# EAGLE design AirSensor (EAGLE 9.6.2)
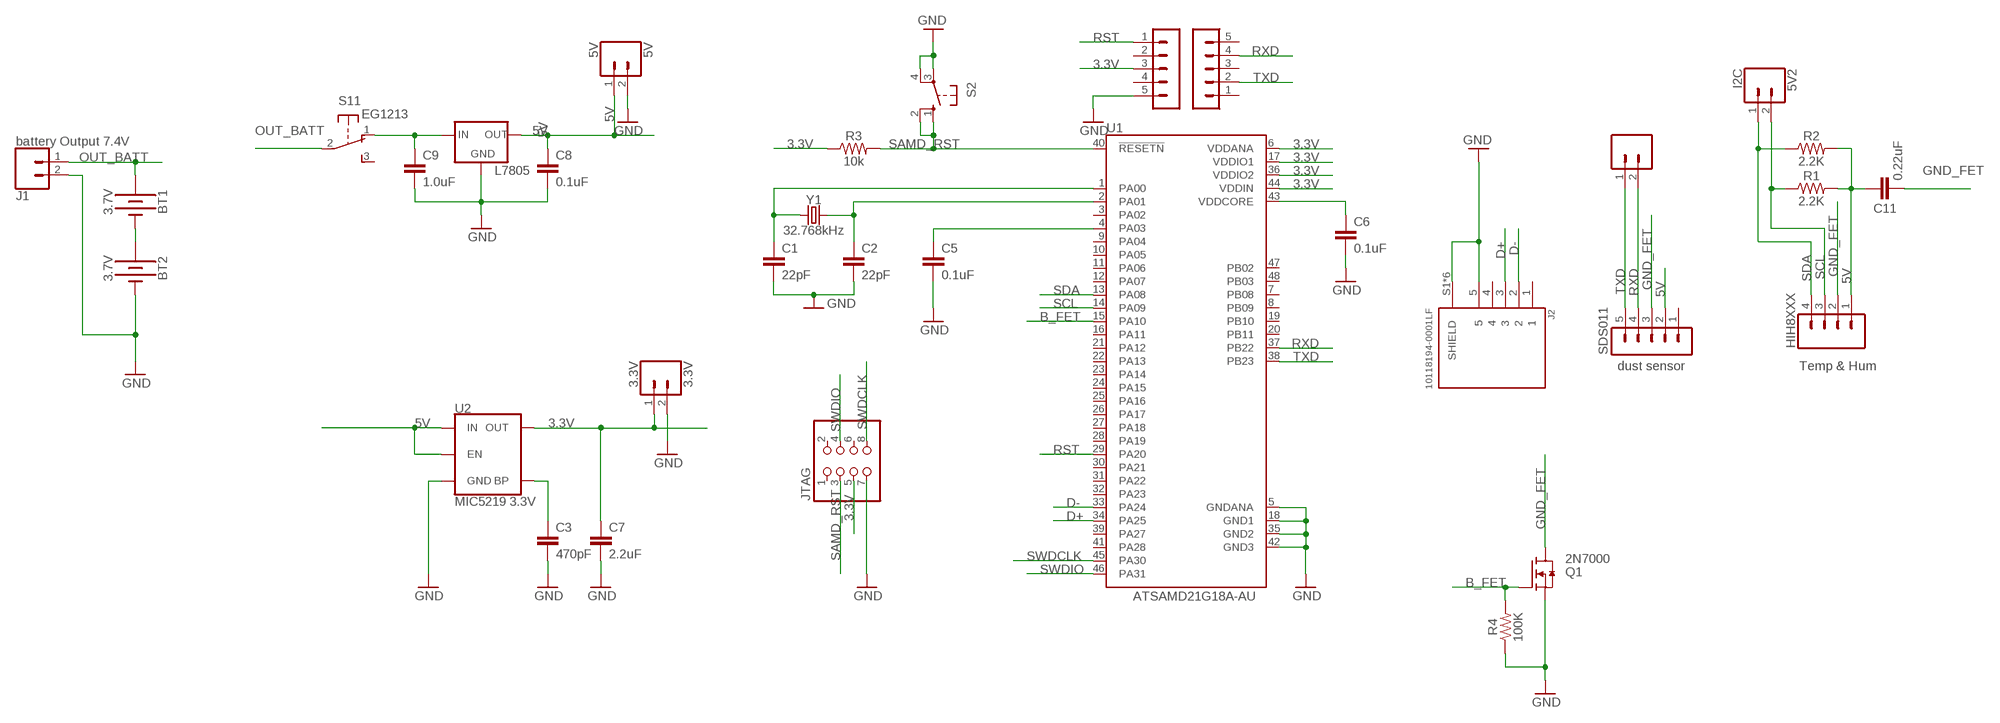
[diagram p0: schematic, sheet 1]

## Parts
3.3V  3.3V  CONN_02  [1X02]
5V  5V  CONN_02  [1X02]
5V1  UART  CONN_02  [1X02]
5V2  I2C  CONN_02  [1X02]
BT1  3.7V  BATTERY-18650  [BATTERY_18650-HOLDER]
BT2  3.7V  BATTERY-18650  [BATTERY_18650-HOLDER]
C1  22pF  1.0UF-0805-25V-10%  [0805]
C2  22pF  1.0UF-0805-25V-10%  [0805]
C3  470pF  1.0UF-0805-25V-10%  [0805]
C5  0.1uF  1.0UF-0805-25V-10%  [0805]
C6  0.1uF  1.0UF-0805-25V-10%  [0805]
C7  2.2uF  1.0UF-0805-25V-10%  [0805]
C8  0.1uF  1.0UF-0805-25V-10%  [0805]
C9  1.0uF  1.0UF-0805-25V-(+80/-20%)  [0805]
C11  0.22uF  1.0UF-0805-25V-10%  [0805]
HIH8XXX  Temp & Hum  CONN_04  [1X04]
J1  battery Output 7.4V  CONN_02  [1X02]
J2  10118194-0001LF  [AMPHENOL_10118194-0001LF]
JTAG  PINHD-2X4  [2X04]
L7805  V_REG_78XXSINK  [TO220-IGO]
Q1  2N7000  [TO92]
R1  2.2K  0.3OHM-0805-1/8W-1%  [0805]
R2  2.2K  0.3OHM-0805-1/8W-1%  [0805]
R3  10k  0.3OHM-0805-1/8W-1%  [0805]
R4  100K  0.3OHM-0805-1/8W-1%  [0805]
RN2483  LoRa1  MA05-1  [MA05-1]
RN2483_2  LoRa_2  MA05-1  [MA05-1]
S1  EG1213  [EG1213]
S2  10-XX  [B3F-10XX]
SDS011  dust sensor  MA05-1  [MA05-1]
U1  ATSAMD21G18A-AU  [QFP50P900X900X120-48N]
U2  MIC5219 3.3V  V_REG_MIC52193.3V  [SOT23-5]
Y1  32.768kHz  CRYSTAL-32.768KHZSMD-3.2X1.5  [CRYSTAL-SMD-3.2X1.5MM]

## Nets
3.3V: 3.3V.1 C7.1 JTAG.5 R3.1 RN2483.3 U1.6(VDDANA) U1.17(VDDIO1) U1.36(VDDIO2) U1.44(VDDIN) U2.5(OUT)
5V: 5V.1 C8.1 C11.1 HIH8XXX.1 L7805.OUT R1.2 R2.2 SDS011.2 U2.1(IN) U2.3(EN)
B_FET: Q1.2(G) R4.2 U1.15(PA10)
D+: J2.3 U1.34(PA25)
D-: J2.2 U1.33(PA24)
GND: 3.3V.2 5V.2 BT2.GND@1(-) C1.2 C2.2 C3.2 C5.2 C6.2 C7.2 C8.2 C9.2 J1.2 J2.5 J2.S1(SHIELD) J2.S2(SHIELD) J2.S3(SHIELD) J2.S4(SHIELD) J2.S5(SHIELD) J2.S6(SHIELD) JTAG.7 L7805.GND Q1.1(S) R4.1 RN2483.5 S2.3(P) S2.4(P1) U1.5(GNDANA) U1.18(GND1) U1.35(GND2) U1.42(GND3) U2.2(GND)
GND_FET: C11.2 HIH8XXX.2 Q1.3(D) SDS011.3
N$4: C5.1 U1.4(PA03)
N$5: C6.1 U1.43(VDDCORE)
N$6: C1.1 U1.1(PA00) Y1.P$1
N$7: C3.1 U2.4(BP)
N$8: BT1.GND@1(-) BT2.PWR@1(+)
N$9: C2.1 U1.2(PA01) Y1.P$2
OUT_BATT: BT1.PWR@1(+) C9.1 J1.1 L7805.IN S1.1(1:O) S1.2(1:P)
RST: RN2483.1 U1.29(PA20)
RXD: 5V1.2 RN2483_2.4 SDS011.4 U1.37(PB22)
SAMD_RST: JTAG.3 R3.2 S2.1(S) S2.2(S1) U1.40(!RESETN)
SCL: 5V2.2 HIH8XXX.3 R1.1 U1.14(PA09)
SDA: 5V2.1 HIH8XXX.4 R2.1 U1.13(PA08)
SWDCLK: JTAG.8 U1.45(PA30)
SWDIO: JTAG.4 U1.46(PA31)
TXD: 5V1.1 RN2483_2.2 SDS011.5 U1.38(PB23)
Unconnected: J2.1 J2.4 JTAG.1 JTAG.2 JTAG.6 RN2483.2 RN2483.4 RN2483_2.1 RN2483_2.3 RN2483_2.5 S1.3(1:S) S1.MT1(MT) S1.MT2(MT) SDS011.1 U1.3(PA02) U1.7(PB08) U1.8(PB09) U1.9(PA04) U1.10(PA05) U1.11(PA06) U1.12(PA07) U1.16(PA11) U1.19(PB10) U1.20(PB11) U1.21(PA12) U1.22(PA13) U1.23(PA14) U1.24(PA15) U1.25(PA16) U1.26(PA17) U1.27(PA18) U1.28(PA19) U1.30(PA21) U1.31(PA22) U1.32(PA23) U1.39(PA27) U1.41(PA28) U1.47(PB02) U1.48(PB03)

## Library data of the parts
3.3V 5V 5V1 5V2 J1 = SparkFun-Connectors:CONN_02: Multi connection point. Often used as Generic Header-pin footprint for 0.1 inch spaced/style header connections On any of the 0.1 inch spaced packages, you can populate with these: Break Away Headers - Straight <https://www.sparkfun.com/products/116> (PRT-00116) Break Away Male Headers - Right Angle <https://www.sparkfun.com/products/553> (PRT-00553) Female Headers <https://www.sparkfun.com/products/115> (PRT-00115) Break Away Headers - Machine Pin <https://www.sparkfun.com/products/117> (PRT-00117) Break Away Female Headers - Swiss Machine Pin <https://www.sparkfun.com/products/743> (PRT-00743) For SCREWTERMINALS and SPRING TERMINALS visit here: Screw Terimnals on SparkFun.com <https://www.sparkfun.com/search/results?term=Screw+Terminals> (5mm/3.5mm/2.54mm spacing) This device is also useful as a general connection point to wire up your design to another part of your project. Our various solder wires solder well into these plated through hole pads. Hook-Up Wire - Assortment (Stranded, 22 AWG) <https://www.sparkfun.com/products/11375> (PRT-11375) Hook-Up Wire - Assortment (Solid Core, 22 AWG) <https://www.sparkfun.com/products/11367> (PRT-11367) View the entire wire category on our website here <https://www.sparkfun.com/categories/141> Special notes: Molex polarized connector foot print use with: PRT-08233 with associated crimp pins and housings. 2.54_SCREWTERM for use with PRT-10571. 3.5mm Screw Terminal footprints for PRT-08084 5mm Screw Terminal footprints for use with PRT-08432
BT1 BT2 = SparkFun-Batteries:BATTERY: Battery - Single Cell A variety of battery chemistries, sizes, and footprints. Device List: 20MM_PTH - Coin Cell Battery Holder - 20mm (PTH) <https://www.sparkfun.com/products/783> 6.8MM_PTH - Coin Cell Battery Holder - 6.8MM(SMD) <https://www.digikey.com/product-detail/en/seiko-instruments/MS621FE-FL11E/728-1057-ND/1889208?WT.srch=1&gclid=CNOQ5a6LzdQCFZS2wAodXCkE0g> 12MM_SMD - Coin Cell Battery Holder - 12mm (SMD) <https://www.sparkfun.com/products/10592> 12MM_PTH - Coin Cell Battery Holder - 12mm (PTH) <https://www.sparkfun.com/products/7948> 20MM_SMD - 20mm Coin Cell Battery Holder (SMD) (2 legs) Used on the Big Time Watch Kit <https://www.sparkfun.com/products/11734> 20MM_SMD_4LEGS - Coin Cell Battery Holder - 20mm (SMD) <https://www.sparkfun.com/products/11892> 20MM_SMD_4LEGS_OVERPASTE - Coin Cell Battery Holder - 20mm (SMD) <https://www.sparkfun.com/products/11892> (Over-paste on the legs) 24.5MM_PTH - Coin Cell Battery Holder - 24.5mm (PTH) <https://www.sparkfun.com/products/8863> 9V - 9V Battery Holder - PC Mount Used on the SparkFun SparkPunk Sound Kit <https://www.sparkfun.com/products/11177> and SparkFun SparkPunk Sequencer Kit <https://www.sparkfun.com/products/12707> 18650 - Battery Holder - 18650 (PTH) <https://www.sparkfun.com/products/13113> AA - Battery Holder - 1xAA (PTH) <https://www.sparkfun.com/products/7949> AAA - Battery Holder - 1xAAA (PTH) <https://www.sparkfun.com/products/12718> AA_KIT - Battery Holder - 1xAA (PTH) <https://www.sparkfun.com/products/7949> Special kit package - pads only have exposed copper on one side of the board. AAA_KIT - Battery Holder - 1xAAA (PTH) <https://www.sparkfun.com/products/12718> Special kit package - pads only have exposed copper on one side of the board.; PROD_ID: BATT-12327; SF_SKU: PRT-13113
C1-C3 C5-C8 C11 = SparkFun-Capacitors:1.0UF: 1µF ceramic capacitors A capacitor is a passive two-terminal electrical component used to store electrical energy temporarily in an electric field.; PROD_ID: CAP-08064; VALUE: 1.0uF
C9 = SparkFun-Capacitors:1.0UF: 1µF ceramic capacitors A capacitor is a passive two-terminal electrical component used to store electrical energy temporarily in an electric field.; PROD_ID: CAP-11625
HIH8XXX = SparkFun-Connectors:CONN_04: Multi connection point. Often used as Generic Header-pin footprint for 0.1 inch spaced/style header connections On any of the 0.1 inch spaced packages, you can populate with these: Break Away Headers - Straight <https://www.sparkfun.com/products/116> (PRT-00116) Break Away Male Headers - Right Angle <https://www.sparkfun.com/products/553> (PRT-00553) Female Headers <https://www.sparkfun.com/products/115> (PRT-00115) Break Away Headers - Machine Pin <https://www.sparkfun.com/products/117> (PRT-00117) Break Away Female Headers - Swiss Machine Pin <https://www.sparkfun.com/products/743> (PRT-00743) For SCREWTERMINALS and SPRING TERMINALS visit here: Screw Terimnals on SparkFun.com <https://www.sparkfun.com/search/results?term=Screw+Terminals> (5mm/3.5mm/2.54mm spacing) This device is also useful as a general connection point to wire up your design to another part of your project. Our various solder wires solder well into these plated through hole pads. Hook-Up Wire - Assortment (Stranded, 22 AWG) <https://www.sparkfun.com/products/11375> (PRT-11375) Hook-Up Wire - Assortment (Solid Core, 22 AWG) <https://www.sparkfun.com/products/11367> (PRT-11367) View the entire wire category on our website here <https://www.sparkfun.com/categories/141> Special notes: Molex polarized connector foot print use with SKU : PRT-08231 with associated crimp pins and housings. 1MM SMD Version SKU: PRT-10208; PROD_ID: CONN-09696
J2 = 10118194-0001LF:10118194-0001LF: Micro Usb, 2.0 Type b, Rcpt, Smt Check prices <https://pricing.snapeda.com/search/part/10118194-0001LF/?ref=eda>; AVAILABILITY: Good; DESCRIPTION: USB - micro B USB 2.0 Receptacle Connector 5 Position Surface Mount, Right Angle; Through Hole; MF: Amphenol ICC (FCI); MP: 10118194-0001LF; PACKAGE: None; PRICE: None; PURCHASE-URL: https://pricing.snapeda.com/search/part/10118194-0001LF/?ref=eda
JTAG = adafruit:PINHD-2X4: PIN HEADER
L7805 = SparkFun-IC-Power:V_REG_78XX: Voltage Regulator Standard 78xx regulator. IGO (Input Ground Output). Spark Fun Electronics SKU : COM-00107
Q1 = 2N7000:2N7000: Check prices <https://pricing.snapeda.com/parts/2N7000/STMicroelectronics/view-part?ref=eda>; AVAILABILITY: Warning; DESCRIPTION: N-Channel 60V 350mA (Tc) 1W (Tc) Through Hole TO-92-3; MF: STMicroelectronics; MP: 2N7000; PACKAGE: TO-92 ON Semiconductor; PRICE: None; PURCHASE-URL: https://pricing.snapeda.com/search/part/2N7000/?ref=eda
R1-R4 = SparkFun-Resistors:0.3OHM: 0.3Ω resistor A resistor is a passive two-terminal electrical component that implements electrical resistance as a circuit element. Resistors act to reduce current flow, and, at the same time, act to lower voltage levels within circuits. - Wikipedia; PROD_ID: RES-11622; VALUE: 0.3
RN2483 RN2483_2 SDS011 = con-lstb:MA05-1: PIN HEADER; OC_FARNELL: unknown; OC_NEWARK: unknown
S1 = EG1213:EG1213: E-Switch right-angle slide SPDT Part #EG1213 http://www.ladyada.net/library/eagle Check prices <https://pricing.snapeda.com/parts/EG1213/E-Switch/view-part?ref=eda>; AVAILABILITY: Good; DESCRIPTION: Slide Switch SPDT Through Hole, Right Angle; MF: E-Switch; MP: EG1213; PACKAGE: None; PRICE: None; PURCHASE-URL: https://pricing.snapeda.com/search/part/EG1213/?ref=eda
S2 = switch-omron:10-XX: OMRON SWITCH; MPN: B3F-1000; OC_FARNELL: 176432; OC_NEWARK: 36M3542
U1 = ATSAMD21G18A-AU:ATSAMD21G18A-AU: Cortex-M0+, 256KB FLASH, 32KB SRAM, USB, DMA, T&R - 48TQFP IND TEMP, GREEN, 1.6-3.6V, 48MHz Check prices <https://pricing.snapeda.com/search/part/ATSAMD21G18A-AU/?ref=eda>; AVAILABILITY: Good; DESCRIPTION: ARM® Cortex®-M0+ SAM D21G Microcontroller IC 32-Bit 48MHz 256KB (256K x 8) FLASH 48-TQFP (7x7); MF: Microchip; MP: ATSAMD21G18A-AU; PACKAGE: TQFP-48 Microchip; PRICE: None; PURCHASE-URL: https://pricing.snapeda.com/search/part/ATSAMD21G18A-AU/?ref=eda
U2 = SparkFun-IC-Power:V_REG_MIC5219: V_REG MIC5219 Standard 3.3V and 5V 500mA LDO voltage regulator in SOT-23 layout. Micrel part MIC5219. BP (by-pass) pin is used to lower output noise with 470pF cap, may be left open.; PROD_ID: VREG-09872
Y1 = SparkFun-Clocks:CRYSTAL-32.768KHZ: 32.768kHz Crystal Frequency: 32.768kHz Frequency Stability: ±20ppm Load Capacitance: 12.5pF (PTH-2X6 & SMD-3.2X1.5), 6pF (SMD-2X6) SparkFun Products: SparkFun BigTime Watch Kit <https://www.sparkfun.com/products/11734> SparkFun nRF52832 Breakout <https://www.sparkfun.com/products/13990> SparkFun Real Time Clock Module <https://www.sparkfun.com/products/12708>; PROD_ID: XTAL-13062

## Board
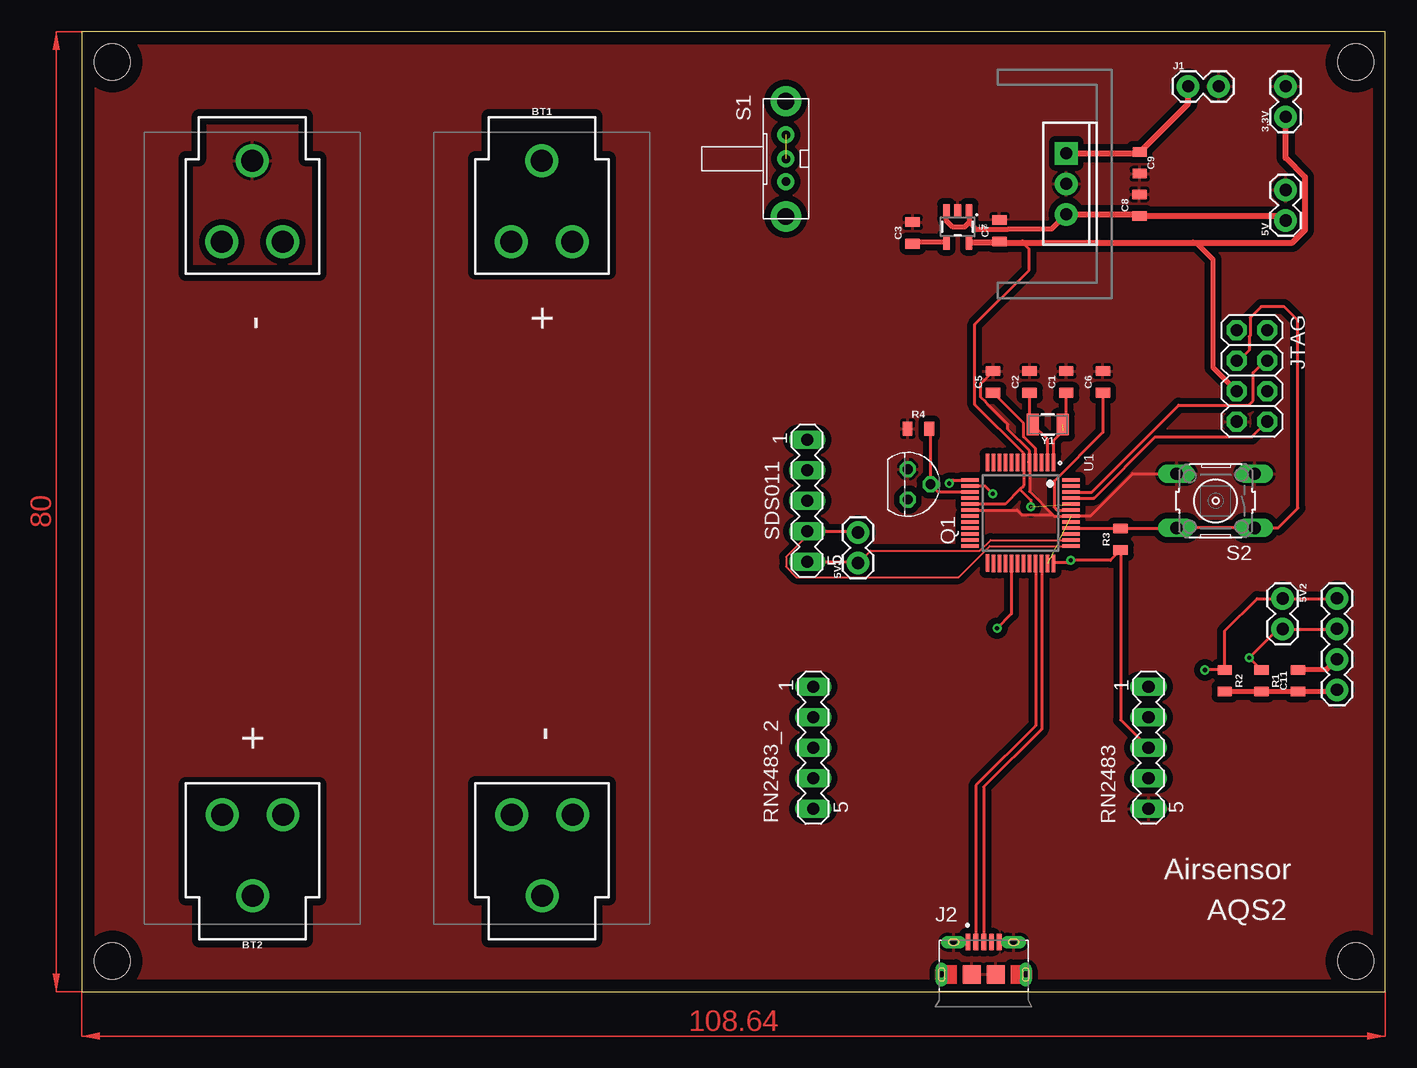
[diagram p1: board, top side]
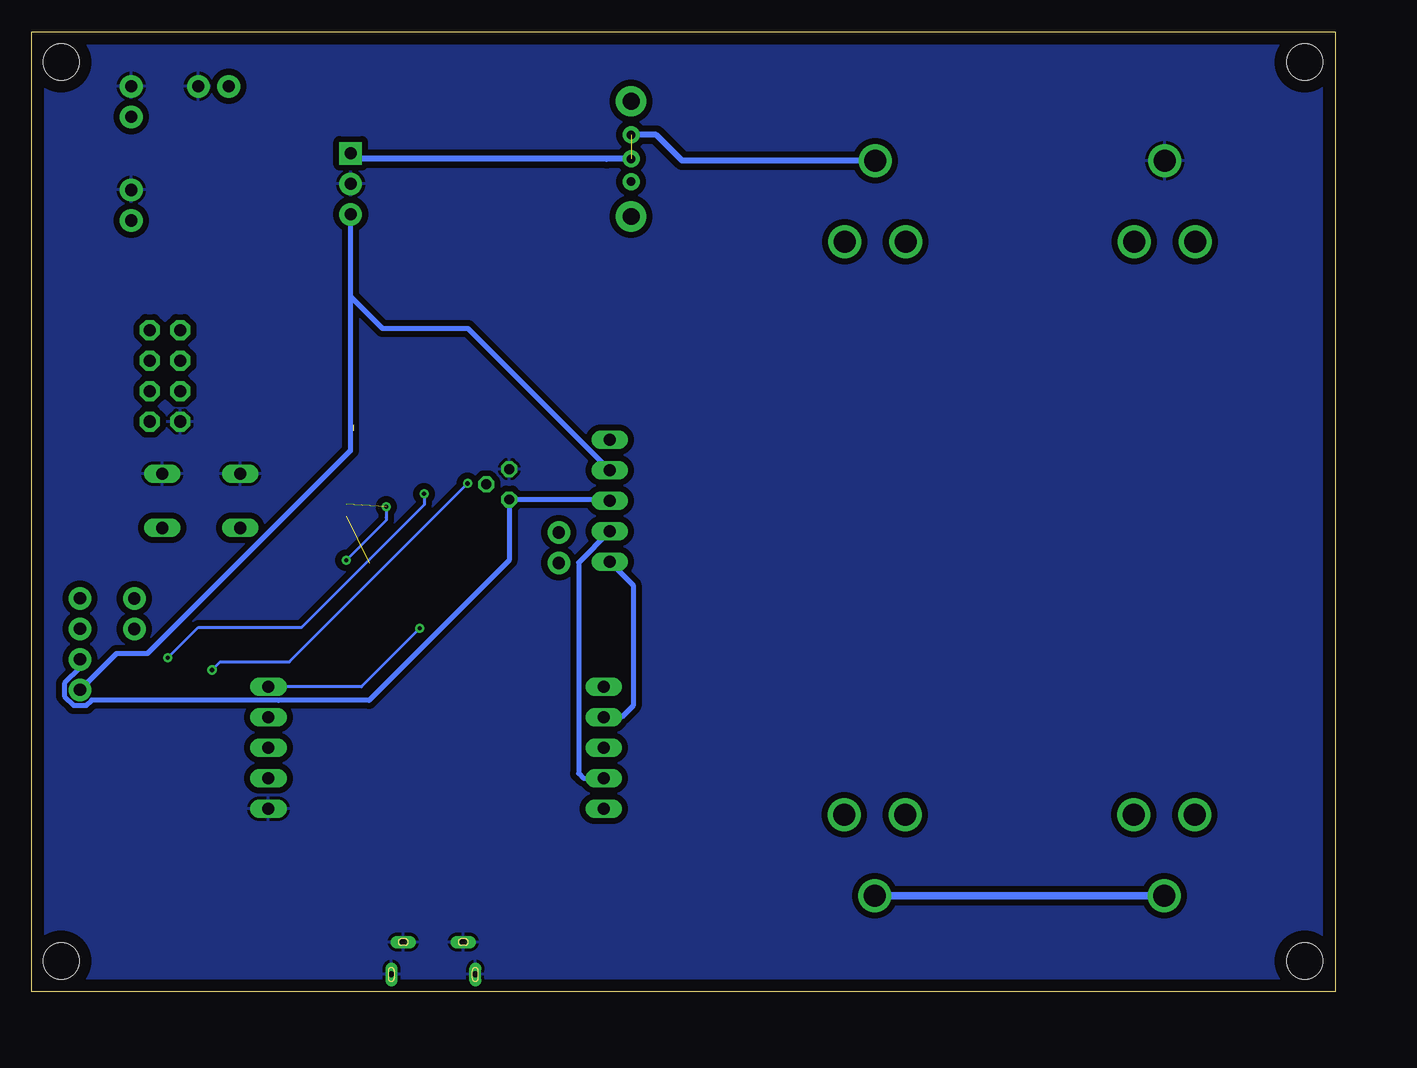
[diagram p2: board, bottom side, seen from below]

Size 108.64 x 80 mm. Coordinates in mm from the lower left corner, seen from the top.
Outline: 0,0 108.64,0 108.64,80 0,80 0,0
Copper layers (1*16): Top 0.035mm / dielectric 1.5mm / Bottom 0.035mm
Design rules "default": minimum track width 6mil, minimum drill 0.35mm, track to track 6mil, track to pad 6mil, pad to pad 6mil, via to via 6mil, smd to smd 6mil, copper to edge 40mil, drill to drill 6mil, minimum pad ring 10mil, minimum via ring 8mil, stop-mask expansion 4mil, vias tented up to drill 0mil, thermal gap 10mil
Holes 3 mm at 2.54,2.54 2.54,77.47 106.17,77.47 106.17,2.54

### Footprints (pad centres in the part's own frame; a part is rotated, then mirrored left to right if it is on the bottom)
1X02 = drill 1.016 pad 1.88: 1 0,0; 2 2.54,0
BATTERY_18650-HOLDER = drill 1.829: GND@1 30.628,0.01; GND@2 23.88,2.55; GND@3 23.88,-2.53; PWR@1 -30.628,-0.01; PWR@2 -23.88,2.53; PWR@3 -23.88,-2.55
0805 = smd 0.8 x 1.2: 1 -0.9,0; 2 0.9,0
1X04 = drill 1.016 pad 1.88: 1 0,0; 2 2.54,0; 3 5.08,0; 4 7.62,0
AMPHENOL_10118194-0001LF = smd 0.4 x 1.35: 1 -1.3,2.7; 2 -0.65,2.7; 3 0,2.7; 4 0.65,2.7; 5 1.3,2.7 | drill 0.55 pad 0.65 long: S1 -2.5,2.7; S2 2.5,2.7 | drill 0.5 pad 0.775 long: S3 -3.5,0; S6 3.5,0 | smd 1.5 x 1.55: S4 -1,0; S5 1,0
2X04 = drill 1.016 pad 1.676 octagon: 1 -3.81,-1.27; 2 -3.81,1.27; 3 -1.27,-1.27; 4 -1.27,1.27; 5 1.27,-1.27; 6 1.27,1.27; 7 3.81,-1.27; 8 3.81,1.27
TO220-IGO = drill 1 pad 1.88: GND 0,0; OUT 2.54,0 | drill 1 pad 1.88 square: IN -2.54,0
TO92 = drill 0.813 octagon: 1 -1.27,0; 2 0,1.905; 3 1.27,0
MA05-1 = drill 1.016 long: 1 -5.08,0; 2 -2.54,0; 3 0,0; 4 2.54,0; 5 5.08,0
EG1213 = drill 0.7 pad 1.422: 1 -2,0; 2 0,0; 3 1.9,0 | drill 1.4 pad 2.54: MT1 -4.8,0; MT2 4.8,0
B3F-10XX = drill 1.016 long: 1 -3.251,2.261; 2 3.251,2.261; 3 -3.251,-2.261; 4 3.251,-2.261
QFP50P900X900X120-48N = smd 1.45 x 0.3: 1 -4.2,2.75; 2 -4.2,2.25; 3 -4.2,1.75; 4 -4.2,1.25; 5 -4.2,0.75; 6 -4.2,0.25; 7 -4.2,-0.25; 8 -4.2,-0.75; 9 -4.2,-1.25; 10 -4.2,-1.75; 11 -4.2,-2.25; 12 -4.2,-2.75; 25 4.17,-2.75; 26 4.2,-2.25; 27 4.2,-1.75; 28 4.2,-1.25; 29 4.2,-0.75; 30 4.2,-0.25; 31 4.2,0.25; 32 4.2,0.75; 33 4.2,1.25; 34 4.2,1.75; 35 4.2,2.25; 36 4.2,2.75 | smd 0.3 x 1.45: 13 -2.75,-4.2; 14 -2.25,-4.2; 15 -1.75,-4.2; 16 -1.25,-4.2; 17 -0.75,-4.2; 18 -0.25,-4.2; 19 0.25,-4.2; 20 0.75,-4.2; 21 1.25,-4.2; 22 1.75,-4.2; 23 2.25,-4.2; 24 2.75,-4.2; 37 2.75,4.2; 38 2.25,4.2; 39 1.75,4.2; 40 1.25,4.2; 41 0.75,4.2; 42 0.25,4.2; 43 -0.25,4.2; 44 -0.75,4.2; 45 -1.25,4.2; 46 -1.75,4.2; 47 -2.25,4.2; 48 -2.75,4.2
SOT23-5 = smd 0.55 x 1.2: 1 -0.95,-1.3; 2 0,-1.3; 3 0.95,-1.3; 4 0.95,1.3; 5 -0.95,1.3
CRYSTAL-SMD-3.2X1.5MM = smd 1 x 1.8: P$1 -1.25,0; P$2 1.25,0

### Placement (x,y rotation side)
3.3V  100.33,72.9 90 top
5V  100.33,64.26 90 top
5V1  64.69,35.71 90 top
5V2  100.08,32.75 270 top
BT1  38.35,38.61 270 top
BT2  14.22,38.61 90 top
C1  82.04,50.8 90 top
C2  78.99,50.8 90 top
C3  69.24,63.22 90 top
C5  75.95,50.8 90 top
C6  85.09,50.8 90 top
C7  76.48,63.4 90 top
C8  88.14,65.53 90 top
C9  88.16,69.06 270 top
C11  101.35,25.91 90 top
HIH8XXX  104.6,25.15 90 top
J1  92.2,75.44 0 top
J2  75.16,1.42 0 top
JTAG  97.51,51.31 270 top
L7805  82.04,67.31 270 top
Q1  68.83,42.27 270 top
R1  98.3,25.91 270 top
R2  95.25,25.91 270 top
R3  86.58,37.69 90 top
R4  69.72,46.9 0 top
RN2483  88.9,20.32 270 top
RN2483_2  60.96,20.32 270 top
S1  58.67,69.39 270 top
S2  94.49,40.89 180 top
SDS011  60.45,40.89 270 top
U1  78.23,39.88 270 top
U2  73,63.73 180 top
Y1  80.52,47.24 180 top

### Tracks (layer width: path | path; a pad name or v marks a point on that pad's centre or on a via)
3.3V  (via drill 0.35)  (1 unrouted)
  Top 0.254: U1.17 76.95,40.63 78.18,41.85 | 78.18,41.85 78.48,42.16 U1.6 78.48,44.85 74.42,48.91 74.42,55.6 78.94,60.12 78.94,61.87 78.41,62.41 | 78.18,41.85 79.09,40.95 v79.09,40.4 v79.08,40.4 | U1.36 81.03,35.72 82.2,35.72 v82.42,35.94 85.72,35.94 R3.1 86.58,22.64 RN2483.3
  Top 0.406: 92.61,62.41 92.86,62.41 94.28,60.98 94.28,51.99 JTAG.5
  Top 0.508: 3.3V.1 100.33,69.47 101.93,67.87 101.93,63.45 100.89,62.41 92.61,62.41 78.41,62.41 76.57,62.41 C7.1 76.41,62.43 U2.5 73.97,62.41
  Bottom 0.254: v79.09,40.4 79.09,39.52 79.07,39.51 79.07,39.29 v82.42,35.94
5V
  Top 0.406: HIH8XXX.1 104.46,25.01 C11.1 R1.2 R2.2 | U2.1 73.95,64.09 | 73.95,64.09 73.56,63.7 72.59,63.7 72.05,64.25 U2.3 | 73.95,64.09 74.5,63.54 77.23,63.54 77.23,63.55 80.82,63.55 L7805.OUT
  Top 0.508: L7805.OUT 88,64.77 C8.1 99.96,64.63 5V.1
  Bottom 0.406: SDS011.2 72.26,55.24 79.38,55.24 82.04,57.91 | 82.04,57.91 L7805.OUT | 82.04,57.91 82.04,45.1 98.98,28.17 101.58,28.17 HIH8XXX.1
B_FET
  Top 0.254: U1.15 71.38,41.63 Q1.2 70.74,46.78 R4.2
D+
  Top 0.254: U1.34 79.98,21.88 75.16,17.05 J2.3
D-
  Top 0.254: U1.33 79.48,22.15 74.51,17.18 J2.2
GND  (1 unrouted)
  Top 0.254: 78.91,44.15 U1.5 | S2.4 87.58,43.16 84.05,39.62 U1.42 81.03,39.63 80.92,39.74 | U1.5 78.98,45.06 77.18,46.86 77.18,47.26 75.34,49.09 75.36,49.09 74.91,49.54 74.91,50.67 C5.2 | U1.5 78.98,41.68 80.92,39.74 | U1.18 77.95,40.13 78.33,39.74 80.92,39.74
  pour Top (isolate 0.508): 0.76,79.25 0.76,0.56 107.99,0.56 107.99,79.25
  pour Bottom (isolate 0.508): 0.51,79.5 0.51,0.53 108.38,0.53 108.38,79.5
GND_FET
  Top 0.406: HIH8XXX.2 103.72,26.81 C11.2
  Bottom 0.406: HIH8XXX.2 104.6,26.98 105.89,25.68 105.89,24.61 105.13,23.85 104.06,23.85 103.63,24.28 88.09,24.28 88.06,24.26 80.5,24.26 68.83,35.93 Q1.3 60.55,41 SDS011.3
N$4
  Top 0.254: C5.1 78.49,47.36 78.49,46.23 79.48,45.23 U1.4
N$5
  Top 0.254: C6.1 85.09,46.61 81.03,42.55 81.03,40.39 81.28,40.13 U1.43
N$6  (1 unrouted)
  Top 0.254: U1.1 80.98,45.93 81.79,46.74 | Y1.P$1 81.77,47.48 82.04,47.75 C1.1
N$7
  Top 0.406: U2.4 69.35,62.43 C3.1
N$8
  Bottom 0.61: BT2.PWR@1 BT1.GND@1
N$9
  Top 0.254: U1.2 80.48,46.03 Y1.P$2 78.99,47.52 C2.1
OUT_BATT  (1 unrouted)
  Top 0.508: L7805.IN 88.05,69.85 C9.1 92.2,74 J1.1
  Bottom 0.508: 60.71,69.37 60.74,69.39 | 60.74,69.39 81.74,69.39 82.04,69.7 L7805.IN | S1.1 56.59,71.39 54.43,69.24 BT1.PWR@1 | S1.2 60.74,69.39
RST  (via drill 0.35)
  Top 0.254: v76.28,30.28 77.47,31.47 77.47,35.67 U1.29
  Bottom 0.254: v76.28,30.28 81.15,25.4 RN2483.1
RXD
  Top 0.152: U1.37 75.66,37.13 73.08,34.54 59.56,34.54 58.7,35.4 58.7,36.22 60.45,37.98 SDS011.4
  Top 0.254: SDS011.4 64.59,38.35 5V1.2
  Bottom 0.406: SDS011.4 63.06,35.75 63.06,18.17 62.66,17.78 RN2483_2.4
SAMD_RST
  Top 0.254: 91.34,38.63 S2.1 99.69,38.63 101.35,40.28 101.35,55.93 100.2,57.07 98.27,57.07 97.36,56.16 97.36,54.66 97.28,54.58 97.28,53.44 96.42,52.58 JTAG.3 | 91.34,38.63 S2.2 | U1.40 86.54,38.63 R3.2 91.3,38.59 91.34,38.63
SCL  (via drill 0.35)
  Top 0.254: R1.1 97.29,27.81 v97.28,27.81 99.68,30.21 5V2.2 104.58,30.21 HIH8XXX.3 | v75.93,41.47 75.27,42.13 U1.14
  Bottom 0.254: v97.28,27.81 94.74,30.35 86.13,30.35 75.93,40.56 v75.93,41.47
SDA  (via drill 0.35)
  Top 0.254: v93.6,26.8 v93.61,26.81 R2.1 95.25,30.06 97.94,32.75 5V2.1 104.58,32.75 HIH8XXX.4 | v72.3,42.34 72.59,42.63 U1.13
  Bottom 0.254: v93.6,26.8 92.91,27.48 87.16,27.48 v72.3,42.34
SWDCLK
  Top 0.254: U1.45 84.36,41.13 89.46,46.23 97.51,46.23 JTAG.8
SWDIO
  Top 0.254: U1.46 84.17,41.63 91.42,48.87 97.23,48.87 97.61,49.25 97.61,51.59 98.6,52.58 JTAG.4
TXD
  Top 0.152: 5V1.1 65.73,36.75 74.85,36.75 75.73,37.63 U1.38
  Top 0.254: SDS011.5 64.59,35.81 5V1.1
  Bottom 0.406: SDS011.5 58.51,33.87 58.51,23.82 59.47,22.86 RN2483_2.2
(copper drawn outside any net)
  shapes: Top area x2

### Text on the board
tNames: Airsensor | AQS2
tValues: ON | 3.3V | OFF | 5V | 3.3V | 5V | TXD | 5V | 3.3V | RXD